# Altium schematic sheet Connectors.SchDoc
size B
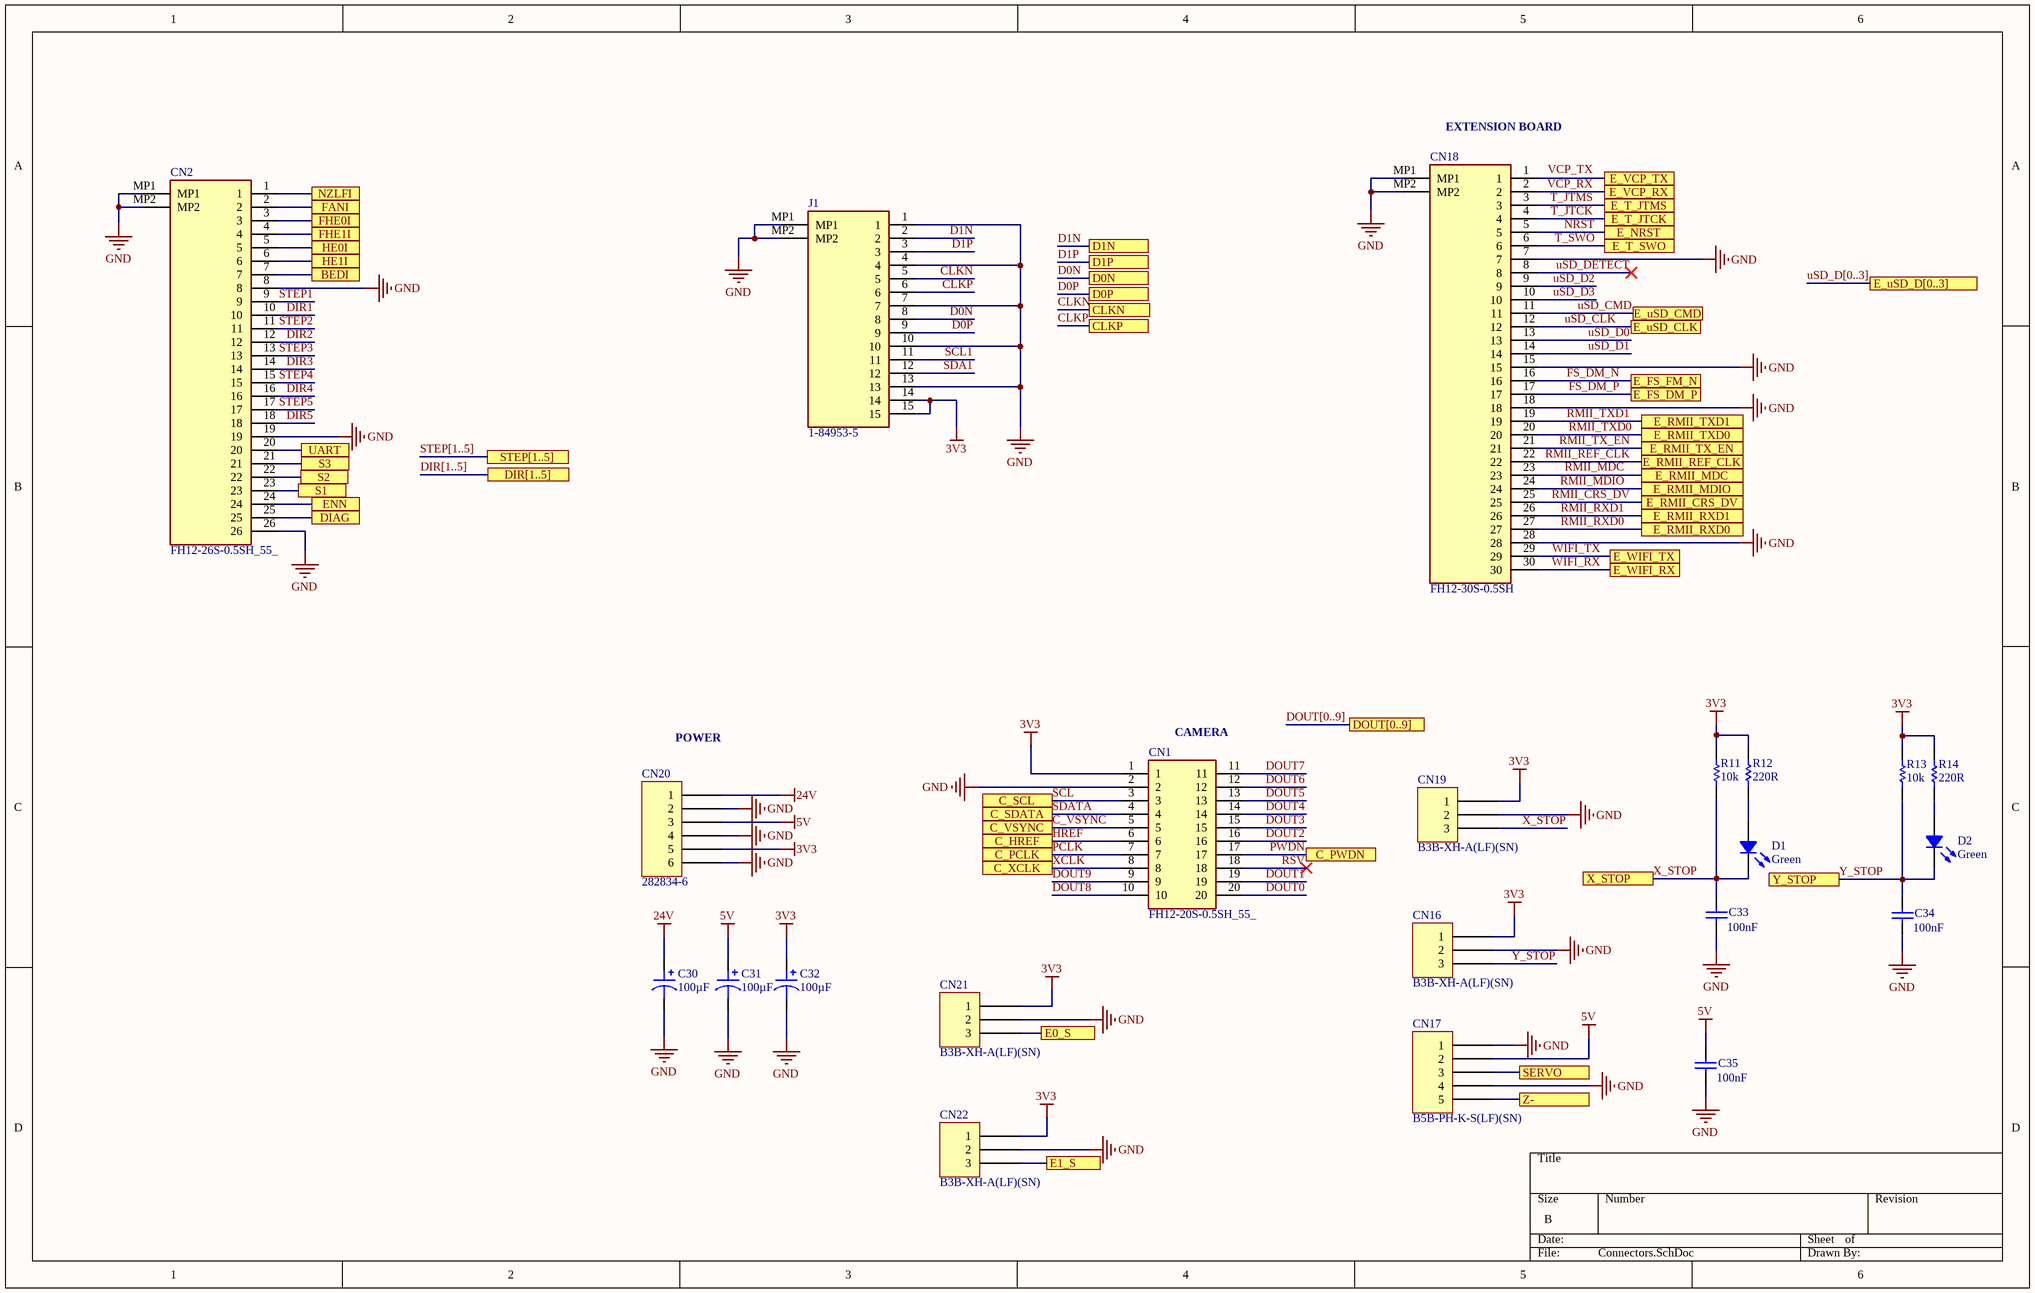
[diagram p0: Connectors.SchDoc]

## Parts
C30  100µF  [CAP ALSMD POLY 5.3MM H6.0MM]
C31  100µF  [CAP ALSMD POLY 5.3MM H6.0MM]
C32  100µF  [CAP ALSMD POLY 5.3MM H6.0MM]
C33  value 100nF  [1608[0603]]  (hidden comment: X5R)
C34  value 100nF  [1608[0603]]  (hidden comment: X5R)
C35  value 100nF  [1608[0603]]  (hidden comment: X5R)
CN1  FH12-20S-0.5SH_55_  [FH12-20S-0.5SH(55)]
CN2  FH12-26S-0.5SH_55_  [FH1226S05SH55]
CN16  B3B-XH-A(LF)(SN)  [JST XH B3B-XH-A]
CN17  B5B-PH-K-S(LF)(SN)  [JST B5B-PH-K]
CN18  FH12-30S-0.5SH  [FH1230S05SH]
CN19  B3B-XH-A(LF)(SN)  [JST XH B3B-XH-A]
CN20  282834-6  [TE 282834-6]
CN21  B3B-XH-A(LF)(SN)  [JST XH B3B-XH-A]
CN22  B3B-XH-A(LF)(SN)  [JST XH B3B-XH-A]
D1  Green  [LED 0805_2012 GREEN]
D2  Green  [LED 0805_2012 GREEN]
J1  1-84953-5  [1849535]
R11  value 10k  [1608[0603]]  (hidden comment: Res1)
R12  value 220R  [1608[0603]]  (hidden comment: Res1)
R13  value 10k  [1608[0603]]  (hidden comment: Res1)
R14  value 220R  [1608[0603]]  (hidden comment: Res1)

## Ports
BEDI, C_HREF, C_PCLK, C_PWDN, C_SCL, C_SDATA, C_VSYNC, C_XCLK, CLKN, CLKP, D0N, D0P, D1N, D1P, DIAG, DIR[1..5], DOUT[0..9], E0_S, E1_S, E_FS_DM_P, E_FS_FM_N, E_NRST, E_RMII_CRS_DV, E_RMII_MDC, E_RMII_MDIO, E_RMII_REF_CLK, E_RMII_RXD0, E_RMII_RXD1, E_RMII_TX_EN, E_RMII_TXD0, E_RMII_TXD1, E_T_JTCK, E_T_JTMS, E_T_SWO, E_uSD_CLK, E_uSD_CMD, E_uSD_D[0..3], E_VCP_RX, E_VCP_TX, E_WIFI_RX, E_WIFI_TX, ENN, FANI, FHE0I, FHE1I, HE0I, HE1I, NZLFI, S1, S2, S3, SERVO, STEP[1..5], UART, X_STOP, Y_STOP, Z-

## Nets
3V3: C32.1 CN1.1 CN16.1 CN19.1 CN20.5 CN21.1 CN22.1 J1.14 J1.15 R11.1 R12.1 R13.1 R14.1
5V: C31.1 C35.1 CN17.2 CN20.3
24V: C30.1 CN20.1
GND: C30.2 C31.2 C32.2 C33.2 C34.2 C35.2 CN1.2 CN2.8 CN2.19 CN2.26 CN2.MP1 CN2.MP2 CN16.2 CN17.1 CN17.4 CN18.7 CN18.15 CN18.18 CN18.28 CN18.MP1 CN18.MP2 CN19.2 CN20.2 CN20.4 CN20.6 CN21.2 CN22.2 J1.1 J1.4 J1.7 J1.10 J1.13 J1.MP1 J1.MP2
BEDI: CN2.7 ; port BEDI
C_VSYNC: CN1.5 ; port C_VSYNC
CLKN: J1.5 ; port CLKN
CLKP: J1.6 ; port CLKP
D0N: J1.8 ; port D0N
D0P: J1.9 ; port D0P
D1N: J1.2 ; port D1N
D1P: J1.3 ; port D1P
DIAG: CN2.25 ; port DIAG
DIR1: CN2.10
DIR2: CN2.12
DIR3: CN2.14
DIR4: CN2.16
DIR5: CN2.18
DOUT0: CN1.20
DOUT1: CN1.19
DOUT2: CN1.16
DOUT3: CN1.15
DOUT4: CN1.14
DOUT5: CN1.13
DOUT6: CN1.12
DOUT7: CN1.11
DOUT8: CN1.10
DOUT9: CN1.9
E0_S: CN21.3 ; port E0_S
E1_S: CN22.3 ; port E1_S
E_RMII_MDC: CN18.23 ; port E_RMII_MDC
E_VCP_TX: CN18.1 ; port E_VCP_TX
ENN: CN2.24 ; port ENN
FANI: CN2.2 ; port FANI
FHE0I: CN2.3 ; port FHE0I
FHE1I: CN2.4 ; port FHE1I
FS_DM_N: CN18.16 ; port E_FS_FM_N
FS_DM_P: CN18.17 ; port E_FS_DM_P
HE0I: CN2.5 ; port HE0I
HE1I: CN2.6 ; port HE1I
HREF: CN1.6 ; port C_HREF
NRST: CN18.5 ; port E_NRST
NZLFI: CN2.1 ; port NZLFI
PCLK: CN1.7 ; port C_PCLK
PWDN: CN1.17 ; port C_PWDN
RMII_CRS_DV: CN18.25 ; port E_RMII_CRS_DV
RMII_MDIO: CN18.24 ; port E_RMII_MDIO
RMII_REF_CLK: CN18.22 ; port E_RMII_REF_CLK
RMII_RXD0: CN18.27 ; port E_RMII_RXD0
RMII_RXD1: CN18.26 ; port E_RMII_RXD1
RMII_TX_EN: CN18.21 ; port E_RMII_TX_EN
RMII_TXD0: CN18.20 ; port E_RMII_TXD0
RMII_TXD1: CN18.19 ; port E_RMII_TXD1
RSV: CN1.18
S1: CN2.23 ; port S1
S2: CN2.22 ; port S2
S3: CN2.21 ; port S3
SCL: CN1.3 ; port C_SCL
SCL1: J1.11
SDA1: J1.12
SDATA: CN1.4 ; port C_SDATA
SERVO: CN17.3 ; port SERVO
STEP1: CN2.9
STEP2: CN2.11
STEP3: CN2.13
STEP4: CN2.15
STEP5: CN2.17
T_JTCK: CN18.4 ; port E_T_JTCK
T_JTMS: CN18.3 ; port E_T_JTMS
T_SWO: CN18.6 ; port E_T_SWO
UART: CN2.20 ; port UART
uSD_CLK: CN18.12 ; port E_uSD_CLK
uSD_CMD: CN18.11 ; port E_uSD_CMD
uSD_D0: CN18.13
uSD_D1: CN18.14
uSD_D2: CN18.9
uSD_D3: CN18.10
uSD_DETECT: CN18.8
VCP_RX: CN18.2 ; port E_VCP_RX
WIFI_RX: CN18.30 ; port E_WIFI_RX
WIFI_TX: CN18.29 ; port E_WIFI_TX
X_STOP: C33.1 CN19.3 D1.2 R11.2 ; port X_STOP
XCLK: CN1.8 ; port C_XCLK
Y_STOP: C34.1 CN16.3 D2.2 R13.2 ; port Y_STOP
Z-: CN17.5 ; port Z-
NetD1_1: D1.1 R12.2
NetD2_1: D2.1 R14.2

## Buses and harness runs
bus DIR[1..5] = port DIR[1..5]
bus DOUT[0..9] = port DOUT[0..9]
bus STEP[1..5] = port STEP[1..5]
bus uSD_D[0..3] = port E_uSD_D[0..3]

## Notes on the sheet
- (near CN18) EXTENSION BOARD
- (near CN20) POWER
- (near CN1) CAMERA
- Labels drawn without touching a wire or pin: RMII_MDC, VCP_TX

## Library data of the parts
C30-C32 = 6SVPC100M: CAP ALUM POLY 100UF 20% 6.3V SMD; manufacturer: Panasonic Electronic Components; ESR (Equivalent Series Resistance): 30mOhm; Lifetime @ Temp.: 2000 Hrs @ 105°C; Ripple Current @ High Frequency: 2.15A @ 100kHz; Ripple Current @ Low Frequency: 107.5mA @ 120Hz; Surface Mount Land Size: 0.209" L x 0.209" W (5.30mm x 5.30mm); Type: Polymer; Part Number: 6SVPC100M; Applications: General Purpose; Capacitance: 100µF; componentlink1description: Datasheet; componentlink1url: https://industrial.panasonic.com/cdbs/www-data/pdf/AAB8000/AAB8000C256.pdf; componentlink2description: DigiKey Link; componentlink2url: http://digikey.com/product-detail/en/panasonic-electronic-components/6SVPC100M/P16606CT-ND/4204442; Device Package: Radial, Can - SMD; Height - Seated (Max): 0.236" (6.00mm); lastupdated: 9/2/2020 1:22:07 AM; Lifecycle Status: Active; Minimum Order: 1; Mounting Type: Surface Mount; Operating Temperature: -55°C ~ 105°C; Package / Case: Radial, Can - SMD; packaging: TapeAndReel; partid: 1943; Part Status: Active; price: 0.51; series: OS-CON™, SVPC; Size / Dimension: 0.197" Dia (5.00mm); Supplier 1: DigiKey; Supplier Part Number 1: P16606CT-ND; Tolerance: ±20%; value: 100µF; Voltage - Rated: 6.3V
C33-C35 = Cap: Capacitor; Published: 8-Jun-2000; LatestRevisionDate: 17-Jul-2002; LatestRevisionNote: Re-released for DXP Platform.; PackageReference: RAD-0.3; Publisher: Altium Limited; PackageDescription: Radial Cap, Thru-Hole; 2 Leads; 0.3 in Pin Spacing
CN1 = FH12-20S-0.5SH_55_: Connector; Manufacturer_Name: Hirose; Datasheet Link: https://componentsearchengine.com/Datasheets/2/FH12-20S-0.5SH(55).pdf; Manufacturer_Part_Number: FH12-20S-0.5SH(55); Mouser Part Number: 798-FH12-20S-0.5SH55; Mouser Price/Stock: https://www.mouser.co.uk/ProductDetail/Hirose-Connector/FH12-20S-0.5SH55?qs=Ux3WWAnHpjBAoMH%252Bjl1N9Q%3D%3D
CN2 = FH12-26S-0.5SH_55_: Connector; Manufacturer_Name: Hirose; Manufacturer_Part_Number: FH12-26S-0.5SH(55); Datasheet Link: https://datasheet.datasheetarchive.com/originals/distributors/SFDatasheet-1/sf-00023459.pdf; Height: 2.2mm; Mouser Part Number: 798-FH12-26S-0.5SH55; Mouser Price/Stock: https://www.mouser.co.uk/ProductDetail/Hirose-Connector/FH12-26S-0.5SH55?qs=Ux3WWAnHpjC%2FipJJsmJDaQ%3D%3D; Arrow Part Number: FH12-26S-0.5SH(55); Arrow Price/Stock: https://www.arrow.com/en/products/fh12-26s-0.5sh-55/hirose-electric
CN16 CN19 CN21 CN22 = B3B-XH-A(LF)(SN): CONN HEADER VERT 3POS 2.5MM; Manufacturer: JST Sales America Inc.; Contact Length - Post: 0.134" (3.40mm); Current Rating (Amps): 3A; Material Flammability Rating: UL94 V-0; Number of Positions: 3; Number of Positions Loaded: All; Pitch - Mating: 0.098" (2.50mm); Shrouding: Shrouded - 4 Wall; Style: Board to Cable/Wire; Voltage Rating: 250V; Part Number: B3B-XH-A(LF)(SN); ComponentLink1Description: Datasheet; ComponentLink1URL: http://www.jst-mfg.com/product/pdf/eng/eXH.pdf; ComponentLink2Description: DigiKey Link; ComponentLink2URL: http://digikey.com/product-detail/en/jst-sales-america-inc/B3B-XH-A-LF-SN/455-2248-ND/1651046; Connector Type: Header; Contact Finish - Mating: Tin; Contact Finish - Post: Tin; Contact Material: Brass; Contact Shape: Square; Contact Type: Male Pin; Fastening Type: Detent Lock; Insulation Color: Natural; Insulation Height: 0.276" (7.00mm); Insulation Material: Polyamide (PA66), Nylon 6/6; LastUpdated: 1/12/2020 11:46:22 PM; Lifecycle Status: Active; Minimum Order: 1; Mounting Type: Through Hole; Number of Rows: 1; Operating Temperature: -25°C ~ 85°C; Packaging: Bulk; PartId: 68; Part Status: Active; Price: 0.19; Series: XH; Supplier 1: DigiKey; Supplier Part Number 1: 455-2248-ND; Termination: Press-Fit, Solder
CN17 = B5B-PH-K-S(LF)(SN): CONN HEADER VERT 5POS 2MM; Manufacturer: JST Sales America Inc.; Contact Length - Mating: 0.130" (3.30mm); Contact Length - Post: 0.134" (3.40mm); Current Rating (Amps): 2A; Material Flammability Rating: UL94 V-0; Number of Positions: 5; Number of Positions Loaded: All; Overall Contact Length: 0.333" (8.45mm); Pitch - Mating: 0.079" (2.00mm); Shrouding: Shrouded - 4 Wall; Style: Board to Cable/Wire; Voltage Rating: 100V; Part Number: B5B-PH-K-S(LF)(SN); ComponentLink1Description: Datasheet; ComponentLink1URL: http://www.jst-mfg.com/product/pdf/eng/ePH.pdf; ComponentLink2Description: DigiKey Link; ComponentLink2URL: http://digikey.com/product-detail/en/jst-sales-america-inc/B5B-PH-K-S-LF-SN/455-1707-ND/926614; Connector Type: Header; Contact Finish - Mating: Tin; Contact Finish - Post: Tin; Contact Material: Brass; Contact Shape: Square; Contact Type: Male Pin; Fastening Type: Detent Lock; Insulation Color: Natural; Insulation Height: 0.236" (6.00mm); Insulation Material: Polyamide (PA66), Nylon 6/6; LastUpdated: 1/12/2020 10:30:05 PM; Lifecycle Status: Active; Minimum Order: 1; Mounting Type: Through Hole; Number of Rows: 1; Operating Temperature: -25°C ~ 85°C; Packaging: Bulk; PartId: 28; Part Status: Active; Price: 0.29; Series: PH; Supplier 1: DigiKey; Supplier Part Number 1: 455-1707-ND; Termination: Press-Fit, Solder
CN18 = FH12-30S-0.5SH: Connector; Manufacturer_Name: Hirose; Datasheet Link: https://datasheet.datasheetarchive.com/originals/dk/DKDS-2/23451.pdf; Height: 4.8mm; Manufacturer_Part_Number: FH12-30S-0.5SH
CN20 = 282834-6: TERM BLK 6P SIDE ENT 2.54MM PCB; Manufacturer: TE Connectivity AMP Connectors; Current: 10A; Mating Orientation: Horizontal with Board; Number of Levels: 1; Pitch: 0.100" (2.54mm); Positions Per Level: 6; Voltage: 150V; Wire Gauge: 16-30 AWG; Wire Termination: Screw - Rising Cage Clamp; Part Number: 282834-6; Color: Green; ComponentLink1Description: Datasheet; ComponentLink1URL: https://www.te.com/commerce/DocumentDelivery/DDEController?Action=srchrtrv&DocNm=282834&DocType=Customer+Drawing&DocLang=English; ComponentLink2Description: DigiKey Link; ComponentLink2URL: http://digikey.com/product-detail/en/te-connectivity-amp-connectors/282834-6/A98337-ND/1153267; LastUpdated: 1/15/2020 4:16:31 AM; Lifecycle Status: Active; Minimum Order: 1; Mounting Type: Through Hole; Packaging: Bulk; Part Status: Active; Price: 4.72; Series: Buchanan; Supplier 1: DigiKey; Supplier Part Number 1: A98337-ND
D1 D2 = QTLP630C4TR: LED GREEN CLEAR 0805 SMD; Manufacturer: Everlight Electronics Co Ltd; Configuration: Standard; Current - Test: 20mA; Lens Color: Colorless; Lens Size: 1.40mm x 1.25mm; Lens Style: Rectangle with Flat Top; Millicandela Rating: 10mcd; Viewing Angle: 140°; Voltage - Forward (Vf) (Typ): 2.1V; Wavelength - Dominant: 570nm; Wavelength - Peak: 565nm; Part Number: QTLP630C4TR; Color: Green; ComponentLink1Description: Datasheet; ComponentLink1URL: //media.digikey.com/PDF/Data%20Sheets/Everlight%20PDFs/QTLP630-2.pdf; ComponentLink2Description: DigiKey Link; ComponentLink2URL: https://www.digikey.com/en/products/detail/everlight-electronics-co-ltd/QTLP630C4TR/2675902; Device Package: 0805 (2012 Metric); Height (Max): 1.20mm; LastUpdated: 3/28/2023 7:59:32 PM; Lens Transparency: Clear; Lifecycle Status: Active; Minimum Order: 1; Mounting Type: Surface Mount; Package / Case: 0805 (2012 Metric); Packaging: TapeAndReel; PartId: 240; Part Status: Active; Price: 0.04; Series: -; Size / Dimension: 2.00mm L x 1.25mm W; Supplier 1: DigiKey; Supplier Part Number 1: 1080-1411-1-ND; Supplier Device Package: 0805; Value: Green
J1 = 1-84953-5: Connector; Manufacturer_Name: TE Connectivity; Datasheet Link: https://www.te.com/commerce/DocumentDelivery/DDEController?Action=showdoc&DocId=Customer+Drawing%7F84953%7FA3%7Fpdf%7FEnglish%7FENG_CD_84953_A3.pdf%7F1-84953-5; Height: 2.74mm; Manufacturer_Part_Number: 1-84953-5; Mouser Part Number: 571-1-84953-5; Mouser Price/Stock: https://www.mouser.co.uk/ProductDetail/TE-Connectivity/1-84953-5?qs=uUkeXfjQ8uS9OOvsO8VIHg%3D%3D; Arrow Part Number: 1-84953-5; Arrow Price/Stock: https://www.arrow.com/en/products/1-84953-5/te-connectivity?region=nac
R11-R14 = Res1: Resistor; Published: 8-Jun-2000; LatestRevisionDate: 17-Jul-2002; LatestRevisionNote: Re-released for DXP Platform.; PackageReference: AXIAL-0.3; Publisher: Altium Limited; PackageDescription: Axial Device, Thru-Hole; 2 Leads; 0.3 in Pin Spacing